# Altium project m_airconditionerV2.0_PRJ.PrjPCB
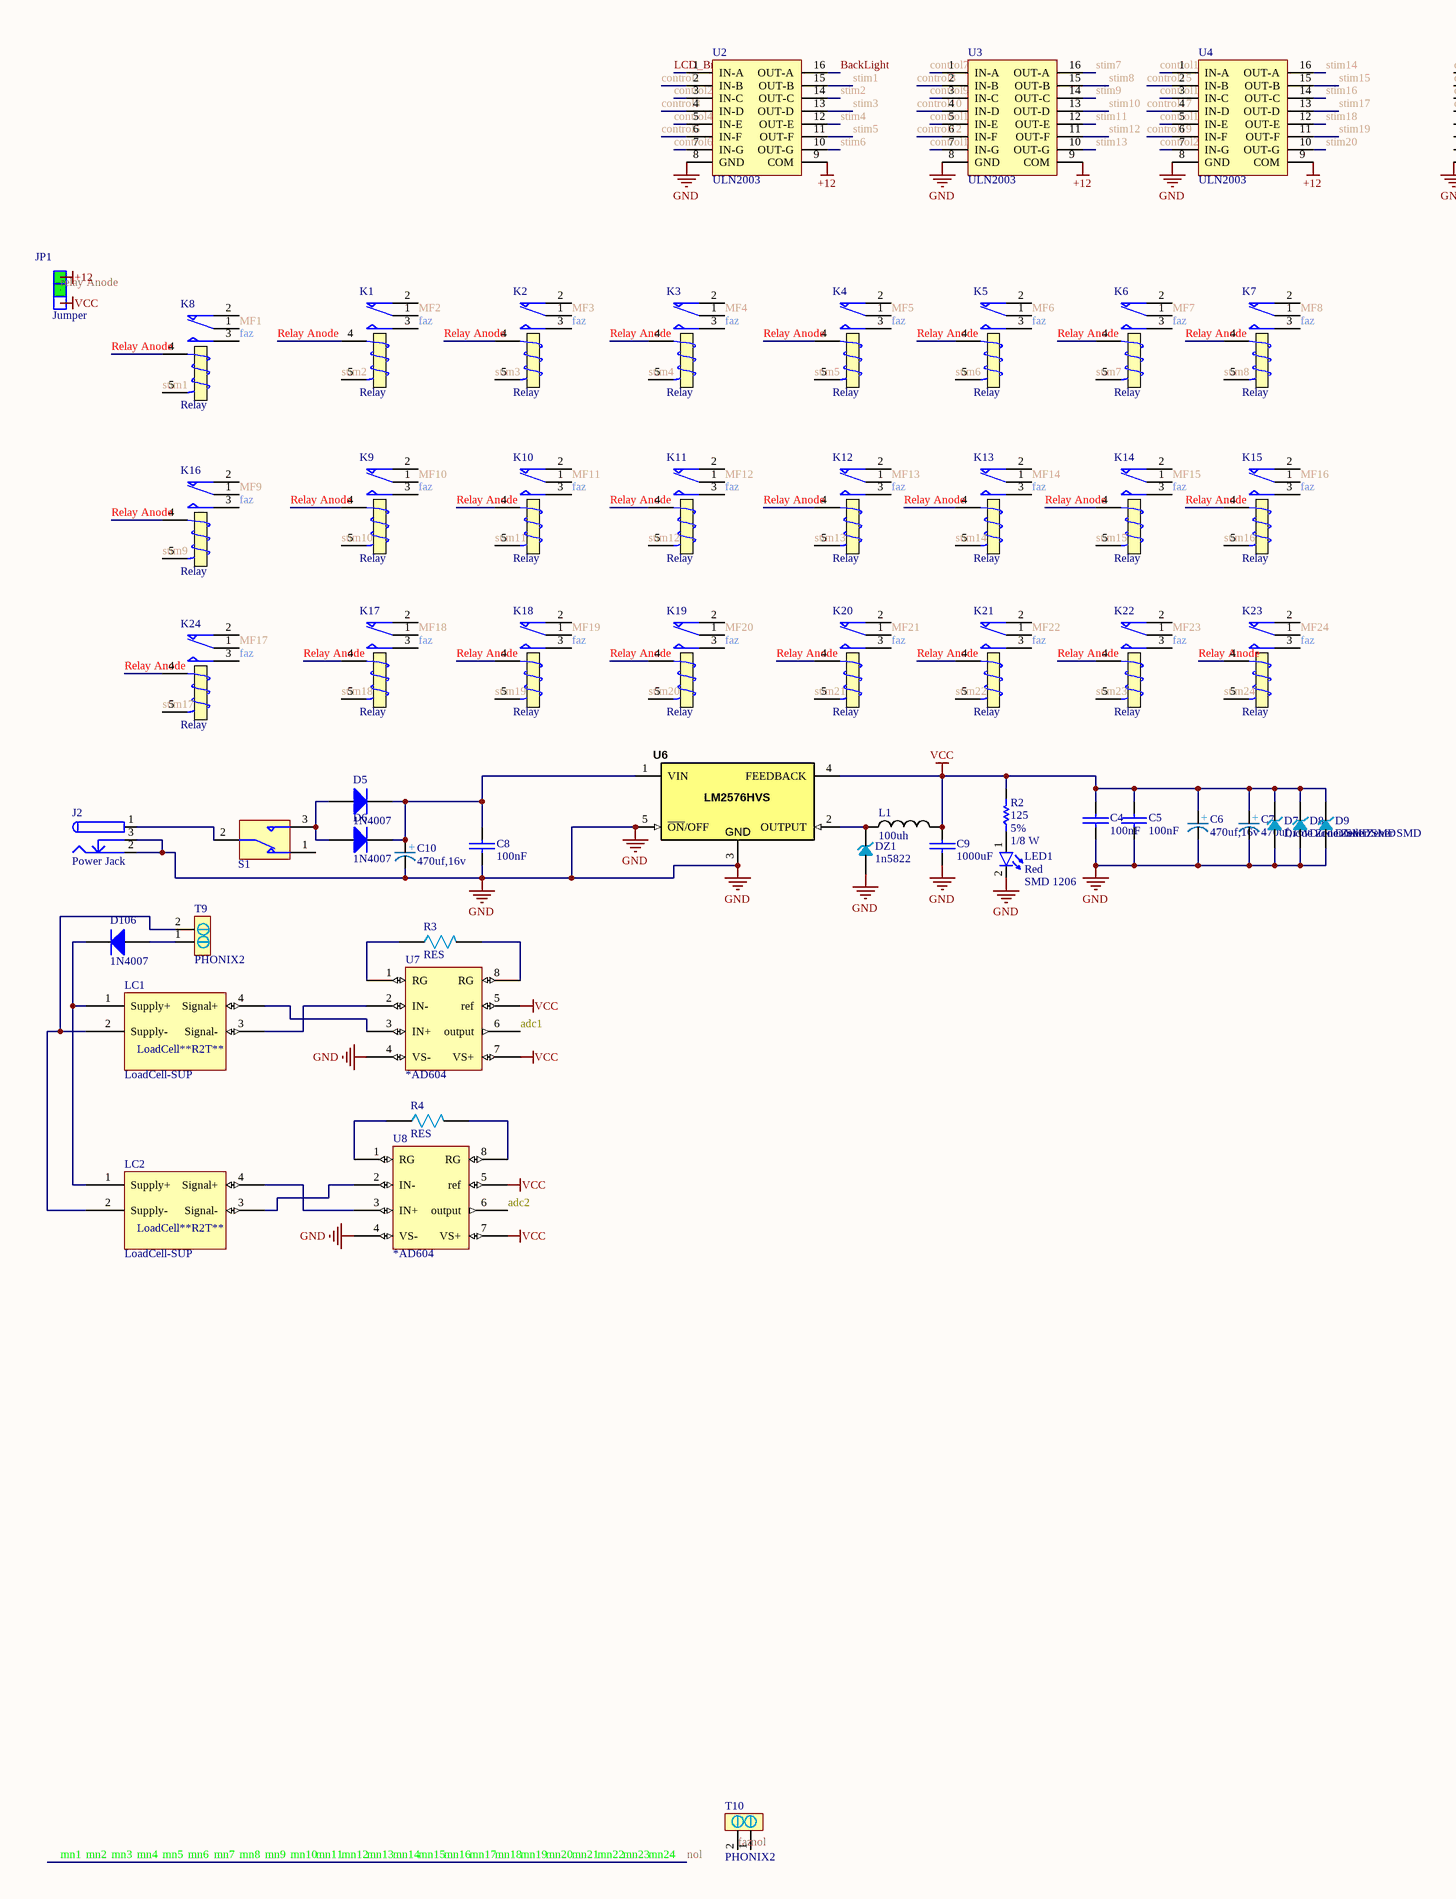
[diagram p0: m_airconditionerV2.0_SCH.SchDoc, left]
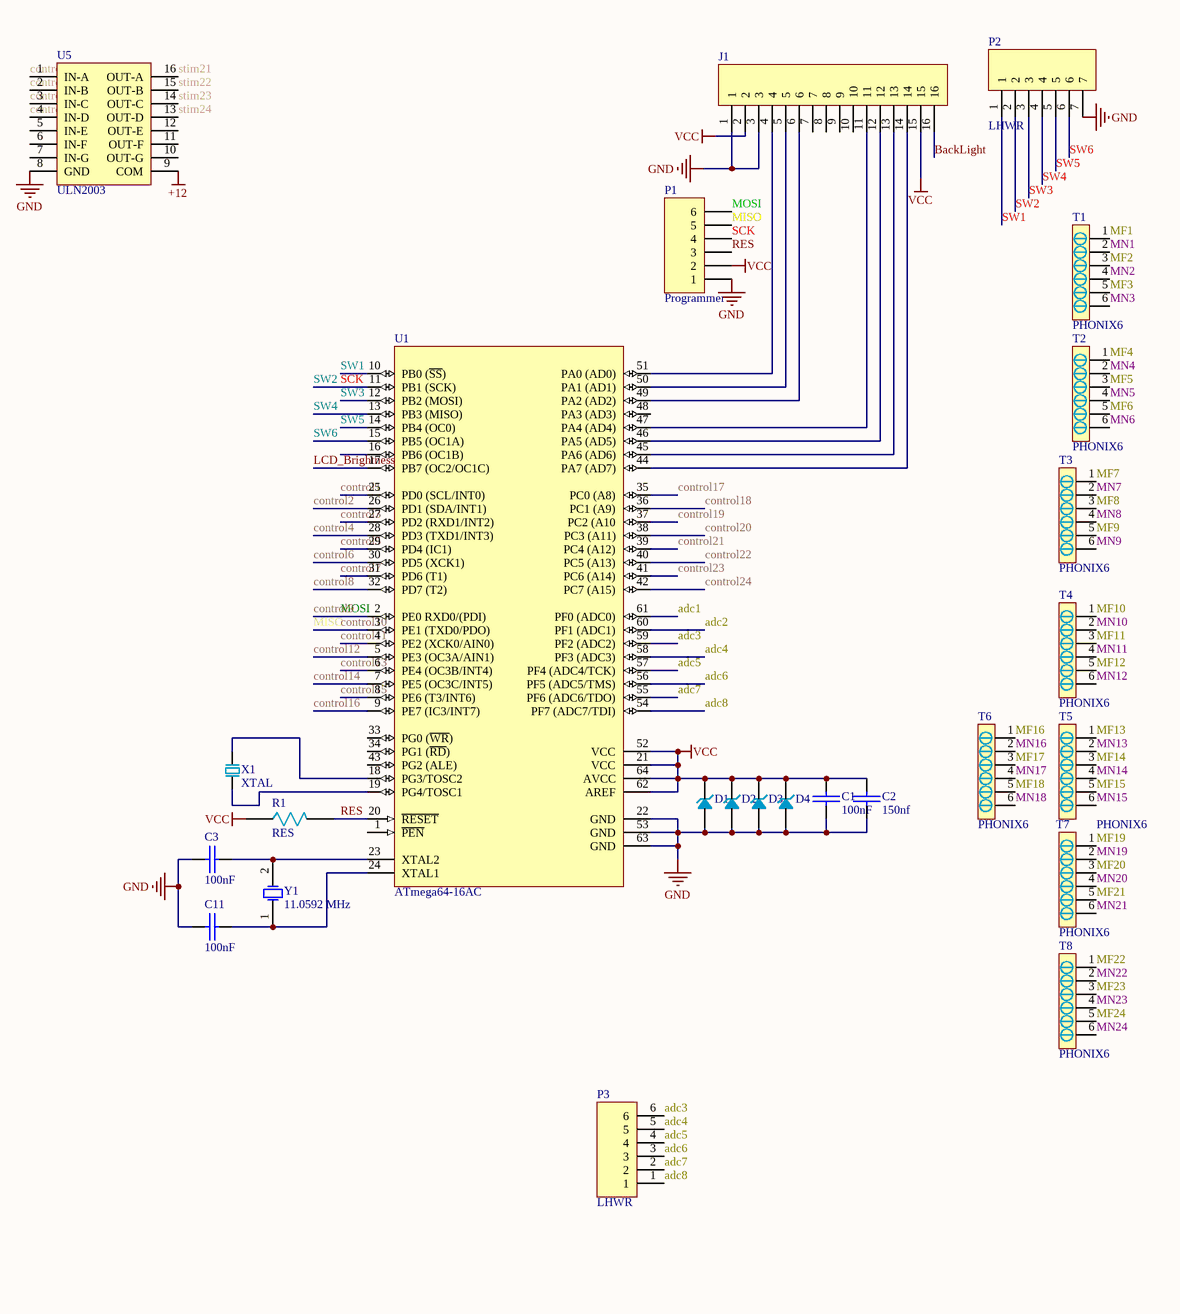
[diagram p1: m_airconditionerV2.0_SCH.SchDoc, right]
1 sheet, 81 parts. Net scope: global (net labels, ports and power ports of the same name join across sheets).
Board file: m_airconditionerV2.0_PCB.PcbDoc

## Sheet m_airconditionerV2.0_SCH.SchDoc
size C

### Parts
C1  100nF  [SMD_CAP_1206]
C2  150nf  [SMD_CAP_1206]
C3  100nF  [CAP 1206 (3216X15L)]
C4  100nF  [SMD_CAP_1206]
C5  100nF  [SMD_CAP_1206]
C6  Description:: 470uf,16v  [Electrolytic Capacitor SMD Dia-8]  (hidden comment: Capacitor Polarized)
C7  Description:: 470uf,16v  [Electrolytic Capacitor SMD Dia-8]  (hidden comment: Capacitor Polarized)
C8  100nF  [SMD_CAP_1206]
C9  1000uF  [SMD_CAP_1206]
C10  Description:: 470uf,16v  [Electrolytic Capacitor SMD Dia-8]  (hidden comment: Capacitor Polarized)
C11  100nF  [CAP 1206 (3216X15L)]
D1  Diode Zener SMD  [DIOMELF3615N]  (value not drawn)
D2  Diode Zener SMD  [DIOMELF3615N]  (value not drawn)
D3  Diode Zener SMD  [DIOMELF3615N]  (value not drawn)
D4  Diode Zener SMD  [DIOMELF3615N]  (value not drawn)
D5  1N4007  [My_DO-41]
D6  1N4007  [My_DO-41]
D7  Diode Zener SMD  [DIOMELF3615N]
D8  Diode Zener SMD  [DIOMELF3615N]
D9  Diode Zener SMD  [DIOMELF3615N]
D106  1N4007  [My_DO-41]
DZ1  1n5822  [ZENER]
J1  SIP16  [SIP16]  (value not drawn)
J2  Power Jack  [Power Jack]
JP1  Jumper  [jumper selector]
K1  Relay  [Relay 15.40x12.10x13.10]
K2  Relay  [Relay 15.40x12.10x13.10]
K3  Relay  [Relay 15.40x12.10x13.10]
K4  Relay  [Relay 15.40x12.10x13.10]
K5  Relay  [Relay 15.40x12.10x13.10]
K6  Relay  [Relay 15.40x12.10x13.10]
K7  Relay  [Relay 15.40x12.10x13.10]
K8  Relay  [Relay 15.40x12.10x13.10]
K9  Relay  [Relay 15.40x12.10x13.10]
K10  Relay  [Relay 15.40x12.10x13.10]
K11  Relay  [Relay 15.40x12.10x13.10]
K12  Relay  [Relay 15.40x12.10x13.10]
K13  Relay  [Relay 15.40x12.10x13.10]
K14  Relay  [Relay 15.40x12.10x13.10]
K15  Relay  [Relay 15.40x12.10x13.10]
K16  Relay  [Relay 15.40x12.10x13.10]
K17  Relay  [Relay 15.40x12.10x13.10]
K18  Relay  [Relay 15.40x12.10x13.10]
K19  Relay  [Relay 15.40x12.10x13.10]
K20  Relay  [Relay 15.40x12.10x13.10]
K21  Relay  [Relay 15.40x12.10x13.10]
K22  Relay  [Relay 15.40x12.10x13.10]
K23  Relay  [Relay 15.40x12.10x13.10]
K24  Relay  [Relay 15.40x12.10x13.10]
L1  100uh  [General 10x12(200m) Inductor]
LC1  LoadCell-SUP  [LoadCell-SUP]
LC2  LoadCell-SUP  [LoadCell-SUP]
LED1  Size: SMD 1206  [LED SMD 1206]  (hidden comment: Red)
P1  Programmer  [HDR1X6]
P2  LHWR  [Polarized Header 7]
P3  LHWR  [Polarized Header 6]
R1  RES  [1206]
R2  Tolerance: 5%  Power: 1/8 W  [RES 1206 (3216X08L)]  (hidden comment: 125)
R3  RES  [1206]
R4  RES  [1206]
S1  Switch SPDT_Subminiator  [SPDT Subminiator]  (value not drawn)
T1  PHONIX6  [PHONIX6]
T2  PHONIX6  [PHONIX6]
T3  PHONIX6  [PHONIX6]
T4  PHONIX6  [PHONIX6]
T5  PHONIX6  [PHONIX6]
T6  PHONIX6  [PHONIX6]
T7  PHONIX6  [PHONIX6]
T8  PHONIX6  [PHONIX6]
T9  PHONIX2  [PHONIX2]
T10  PHONIX2  [PHONIX2]
U1  ATmega64-16AC  [64A_N]
U2  ULN2003  [SO-16]
U3  ULN2003  [SO-16]
U4  ULN2003  [SO-16]
U5  ULN2003  [SO-16]
U6  Adjustable  [TO-263-5]  (value not drawn)
U7  *AD604  [AD620-Soic]
U8  *AD604  [AD620-Soic]
X1  XTAL  [XTAL2]
Y1  11.0592 MHz  [Crystal SMD]

### Nets
+12: JP1.1 U2.9(COM) U3.9(COM) U4.9(COM) U5.9(COM)
GND: C1.2(-) C2.2(-) C3.1(+) C4.2(-) C5.2(-) C6.2 C7.2 C8.2(-) C9.2(-) C10.2 C11.1(+) D1.2 D2.2 D3.2 D4.2 D7.2 D8.2 D9.2 DZ1.1 J1.1 J1.3 J2.2 J2.3 LED1.2(K) P1.1 P2.7 U1.22(GND) U1.53(GND) U1.63(GND) U2.8(GND) U3.8(GND) U4.8(GND) U5.8(GND) U6.3(GND) U6.5(~{ON}/OFF) U7.4(VS-) U8.4(VS-)
VCC: C1.1(+) C2.1(+) C4.1(+) C5.1(+) C6.1 C7.1 C9.1(+) D1.1 D2.1 D3.1 D4.1 D7.1 D8.1 D9.1 J1.2 J1.15 JP1.3 L1.0 P1.2 R1.1 R2.2 U1.21(VCC) U1.52(VCC) U1.62(AREF) U1.64(AVCC) U6.4(FEEDBACK) U7.5(ref) U7.7(VS+) U8.5(ref) U8.7(VS+)
adc1: U1.61(PF0_(ADC0)) U7.6(output)
adc2: U1.60(PF1_(ADC1)) U8.6(output)
adc3: P3.6 U1.59(PF2_(ADC2))
adc4: P3.5 U1.58(PF3_(ADC3))
adc5: P3.4 U1.57(PF4_(ADC4/TCK))
adc6: P3.3 U1.56(PF5_(ADC5/TMS))
adc7: P3.2 U1.55(PF6_(ADC6/TDO))
adc8: P3.1 U1.54(PF7_(ADC7/TDI))
BackLight: J1.16 U2.16(OUT-A)
control1: U1.25(PD0_(SCL/INT0)) U2.2(IN-B)
control2: U1.26(PD1_(SDA/INT1)) U2.3(IN-C)
control3: U1.27(PD2_(RXD1/INT2)) U2.4(IN-D)
control4: U1.28(PD3_(TXD1/INT3)) U2.5(IN-E)
control5: U1.29(PD4_(IC1)) U2.6(IN-F)
control6: U1.30(PD5_(XCK1)) U2.7(IN-G)
control7: U1.31(PD6_(T1)) U3.1(IN-A)
control8: U1.32(PD7_(T2)) U3.2(IN-B)
control9: P1.6 U1.2(PE0_RXD0/(PDI)) U3.3(IN-C)  [also labelled MOSI]
control10: P1.5 U1.3(PE1_(TXD0/PDO)) U3.4(IN-D)  [also labelled MISO]
control11: U1.4(PE2_(XCK0/AIN0)) U3.5(IN-E)
control12: U1.5(PE3_(OC3A/AIN1)) U3.6(IN-F)
control13: U1.6(PE4_(OC3B/INT4)) U3.7(IN-G)
control14: U1.7(PE5_(OC3C/INT5)) U4.1(IN-A)
control15: U1.8(PE6_(T3/INT6)) U4.2(IN-B)
control16: U1.9(PE7_(IC3/INT7)) U4.3(IN-C)
control17: U1.35(PC0_(A8)) U4.4(IN-D)
control18: U1.36(PC1_(A9)) U4.5(IN-E)
control19: U1.37(PC2_(A10) U4.6(IN-F)
control20: U1.38(PC3_(A11)) U4.7(IN-G)
control21: U1.39(PC4_(A12)) U5.1(IN-A)
control22: U1.40(PC5_(A13)) U5.2(IN-B)
control23: U1.41(PC6_(A14)) U5.3(IN-C)
control24: U1.42(PC7_(A15)) U5.4(IN-D)
faz: K1.3(NO) K2.3(NO) K3.3(NO) K4.3(NO) K5.3(NO) K6.3(NO) K7.3(NO) K8.3(NO) K9.3(NO) K10.3(NO) K11.3(NO) K12.3(NO) K13.3(NO) K14.3(NO) K15.3(NO) K16.3(NO) K17.3(NO) K18.3(NO) K19.3(NO) K20.3(NO) K21.3(NO) K22.3(NO) K23.3(NO) K24.3(NO) T10.2
LCD_Brightness: U1.17(PB7_(OC2/OC1C)) U2.1(IN-A)
MF1: K8.1(COM) T1.1
MF2: K1.1(COM) T1.3
MF3: K2.1(COM) T1.5
MF4: K3.1(COM) T2.1
MF5: K4.1(COM) T2.3
MF6: K5.1(COM) T2.5
MF7: K6.1(COM) T3.1
MF8: K7.1(COM) T3.3
MF9: K16.1(COM) T3.5
MF10: K9.1(COM) T4.1
MF11: K10.1(COM) T4.3
MF12: K11.1(COM) T4.5
MF13: K12.1(COM) T5.1
MF14: K13.1(COM) T5.3
MF15: K14.1(COM) T5.5
MF16: K15.1(COM) T6.1
MF17: K24.1(COM) T6.3
MF18: K17.1(COM) T6.5
MF19: K18.1(COM) T7.1
MF20: K19.1(COM) T7.3
MF21: K20.1(COM) T7.5
MF22: K21.1(COM) T8.1
MF23: K22.1(COM) T8.3
MF24: K23.1(COM) T8.5
MN1: T1.2 T1.4 T1.6 T2.2 T2.4 T2.6 T3.2 T3.4 T3.6 T4.2 T4.4 T4.6 T5.2 T5.4 T5.6 T6.2 T6.4 T6.6 T7.2 T7.4 T7.6 T8.2 T8.4 T8.6 T10.1  [also labelled MN10, MN11, MN12, MN13, MN14, MN15, MN16, MN17, MN18, MN19, MN2, MN20, MN21, MN22, MN23, MN24, MN3, MN4, MN5, MN6, MN7, MN8, MN9, nol]
Relay Anode: JP1.2 K1.4(T1) K2.4(T1) K3.4(T1) K4.4(T1) K5.4(T1) K6.4(T1) K7.4(T1) K8.4(T1) K9.4(T1) K10.4(T1) K11.4(T1) K12.4(T1) K13.4(T1) K14.4(T1) K15.4(T1) K16.4(T1) K17.4(T1) K18.4(T1) K19.4(T1) K20.4(T1) K21.4(T1) K22.4(T1) K23.4(T1) K24.4(T1)
RES: P1.3 R1.2 U1.20(~{RESET})
SCK: P1.4 P2.2 U1.11(PB1_(SCK))  [also labelled SW2]
stim1: K8.5(T2) U2.15(OUT-B)
stim2: K1.5(T2) U2.14(OUT-C)
stim3: K2.5(T2) U2.13(OUT-D)
stim4: K3.5(T2) U2.12(OUT-E)
stim5: K4.5(T2) U2.11(OUT-F)
stim6: K5.5(T2) U2.10(OUT-G)
stim7: K6.5(T2) U3.16(OUT-A)
stim8: K7.5(T2) U3.15(OUT-B)
stim9: K16.5(T2) U3.14(OUT-C)
stim10: K9.5(T2) U3.13(OUT-D)
stim11: K10.5(T2) U3.12(OUT-E)
stim12: K11.5(T2) U3.11(OUT-F)
stim13: K12.5(T2) U3.10(OUT-G)
stim14: K13.5(T2) U4.16(OUT-A)
stim15: K14.5(T2) U4.15(OUT-B)
stim16: K15.5(T2) U4.14(OUT-C)
stim17: K24.5(T2) U4.13(OUT-D)
stim18: K17.5(T2) U4.12(OUT-E)
stim19: K18.5(T2) U4.11(OUT-F)
stim20: K19.5(T2) U4.10(OUT-G)
stim21: K20.5(T2) U5.16(OUT-A)
stim22: K21.5(T2) U5.15(OUT-B)
stim23: K22.5(T2) U5.14(OUT-C)
stim24: K23.5(T2) U5.13(OUT-D)
SW1: P2.1 U1.10(PB0_(~{SS}))
SW3: P2.3 U1.12(PB2_(MOSI))
SW4: P2.4 U1.13(PB3_(MISO))
SW5: P2.5 U1.14(PB4_(OC0))
SW6: P2.6 U1.15(PB5_(OC1A))
NetC3_2: C3.2(-) U1.23(XTAL2) Y1.2(OSC2)
NetC8_1: C8.1(+) C10.1 D5.K D6.K U6.1(VIN)
NetC11_2: C11.2(-) U1.24(XTAL1) Y1.1(OSC1)
NetD5_A: D5.A D6.A S1.3
NetD106_A: D106.A T9.1
NetD106_K: D106.K LC1.1(Supply+) LC2.1(Supply+)
NetDZ1_2: DZ1.2 L1.1 U6.2(OUTPUT)
NetJ1_4: J1.4 U1.51(PA0_(AD0))
NetJ1_5: J1.5 U1.50(PA1_(AD1))
NetJ1_6: J1.6 U1.49(PA2_(AD2))
NetJ1_11: J1.11 U1.47(PA4_(AD4))
NetJ1_12: J1.12 U1.46(PA5_(AD5))
NetJ1_13: J1.13 U1.45(PA6_(AD6))
NetJ1_14: J1.14 U1.44(PA7_(AD7))
NetJ2_1: J2.1 S1.2
NetLC1_2: LC1.2(Supply-) LC2.2(Supply-) T9.2
NetLC1_3: LC1.3(Signal-) U7.2(IN-)
NetLC1_4: LC1.4(Signal+) U7.3(IN+)
NetLC2_3: LC2.3(Signal-) U8.2(IN-)
NetLC2_4: LC2.4(Signal+) U8.3(IN+)
NetLED1_1: LED1.1(A) R2.1
NetR3_1: R3.1 U7.1(RG)
NetR3_2: R3.2 U7.8(RG)
NetR4_1: R4.1 U8.1(RG)
NetR4_2: R4.2 U8.8(RG)
NetU1_18: U1.18(PG3/TOSC2) X1.2
NetU1_19: U1.19(PG4/TOSC1) X1.1

Not connected (* = marked no-connect by the designer): J1 7 8 9 10; K1 2(NC); K2 2(NC); K3 2(NC); K4 2(NC); K5 2(NC); K6 2(NC); K7 2(NC); K8 2(NC); K9 2(NC); K10 2(NC); K11 2(NC); K12 2(NC); K13 2(NC); K14 2(NC); K15 2(NC); K16 2(NC); K17 2(NC); K18 2(NC); K19 2(NC); K20 2(NC); K21 2(NC); K22 2(NC); K23 2(NC); K24 2(NC); S1 1; U1 1(~{PEN}) 16(PB6_(OC1B)) 33(PG0_(~{WR})) 34(PG1_(~{RD})) 43(PG2_(ALE)) 48(PA3_(AD3)); U5 5(IN-E) 6(IN-F) 7(IN-G) 10(OUT-G) 11(OUT-F) 12(OUT-E)

### Notes on the sheet
- (in symbol Capacitor Polarized) +
- (in symbol LoadCell-SUP) LoadCell**R2T**

### Library data of the parts
C1-C5 C8 C9 C11 = Cap-Bipolar: Bipolar Capacitor; Voltage: 100V; Designer: Saeid Jorablo; Organazation: ControTec; Adding Date: 1387/12/20
  C1 C3-C5 C8 C11: Value: 100nF
  C2: Value: 150nf
  C9: Value: 1000uF
C6 C7 C10 = Capacitor Polarized: Designer: Hamed Jafarzadeh ( R2T )
D1 = Diode Zener SMD: 5.3v; Designer: Hamed Jafarzadeh
D2-D4 D7-D9 = Diode Zener SMD: Designer: Hamed Jafarzadeh
D5 D6 D106 = 1N4007: 1 Amp Diode
DZ1 = ZENER
J2 = Power Jack: Designer: Saeid Jorablo; Company: Personal; Project Name: Laser; Adding Date: 10/21/2009
JP1 = Jumper Selector
K1-K24 = Relay: SPDT Relay; Designer: Eng. Saeid Jorablo; Company: E.P.I.L; Design_Date: 2011/10/31
L1 = Inductor: Designer:: Hamed Jafarzadeh - hjafarzadeh511@gmail.com
LED1 = LED: Designer: Saeid Jorablo; Organazation: ControTec; Adding Date: 1387/12/22; Color: Red
P1 = Header 6: Header, 6-Pin; LatestRevisionDate: 17-Jul-2002; LatestRevisionNote: Re-released for DXP Platform.; Publisher: Altium Limited
P2 = 7pin LHWR: Designer:: Hamed Jafarzadeh - www.R2T.ir
P3 = 6pin LHWR: Designer:: Hamed Jafarzadeh - www.R2T.ir
R2 = Resistor: Value: 125
S1 = Switch SPDT_Subminiator: Subminiator SPDT Switch; Company: E.P.I.L; Design date: 2011/11/02
U1 = ATmega64-16AC: 8-Bit AVR Microcontroller with 64K Bytes of In-System Programmable Flash Memory; Published: 17-Sep-2003; LatestRevisionDate: 13-Apr-2006; LatestRevisionNote: IPC-7351 Footprint Added.; DatasheetVersion: 2490C-AVR-009/02; PackageVersion: revB, Oct-2001; PackageReference: 64A; Publisher: Altium Limited; PackageDescription: 64-Pin Thin Quad Flat Pack 0.8 mm Pitch; Code_JEDEC: MS-026-AEB; ComponentLink1Description: Manufacturer Link; ComponentLink1URL: http://www.atmel.com; ComponentLink2Description: Datasheet; ComponentLink2URL: http://www.atmel.com/dyn/resources/prod_documents/doc2490.pdf
U6 = LM2576HVS: Switching Voltage Regulator IC, TO-263-5 SMD, LM2591HVS-5.0; Manufacturer 1: National Semiconductor; Voltage Regulator Type: Switching Buck; Tolerance: ±4%; Ratings: 60Vin Max; 150kHz; Value: 5V; 1A; SCDType: source; Package / Case: TO-263-5; Supplier 1: Digi-Key; Supplier Part Number 1: LM2591HVS-5.0-ND; Manufacturer Part Number 1: LM2576HVS
U7 U8 = AD620: Instrumental Amplifire
Y1 = XTAL: XTAL Crystal; Company: E.P.I.L; Design Date: 11/04/2011; Value: 11.0592 MHz